# Altium schematic sheet 02 - PIO muxing.SchDoc
size B; CompanyName: Microchip Technology Inc.; Organization: Microchip Technology; Address1: 2355 West Chandler Blvd.; Address2: Chandler, AZ  85224; Address4: USA; DocumentNumber: 2; SheetNumber: 2; SheetTotal: 15; SheetTitle: PIO Muxing; Time: Time
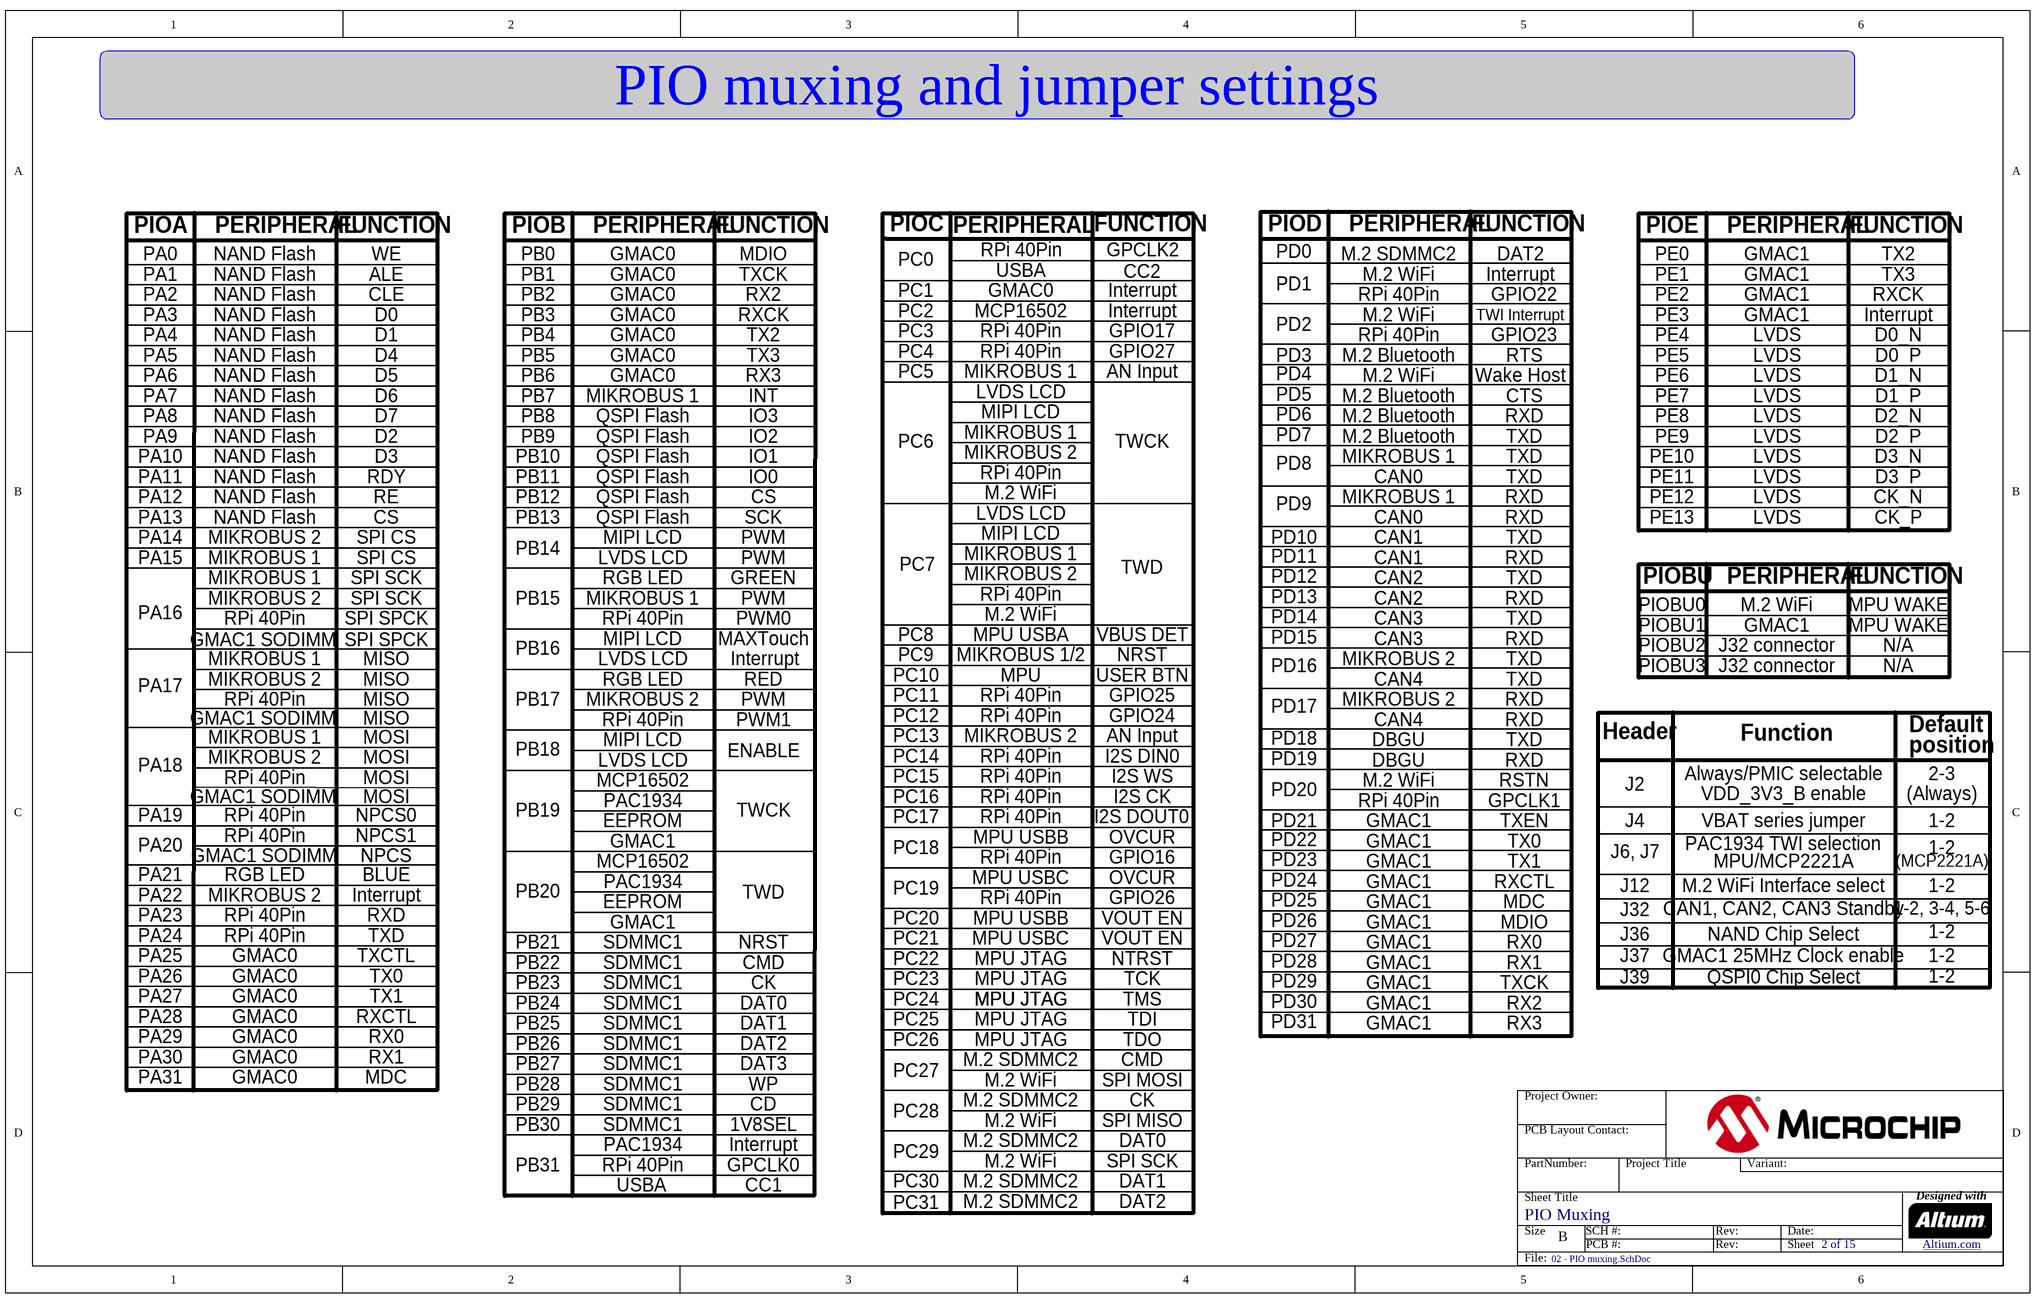
[diagram p0: 02 - PIO muxing.SchDoc]

## Notes on the sheet
- PIO muxing and jumper settings
- PIOA
- PERIPHERAL
- FUNCTION
- PIOB
- PIOC
- PIOD
- PIOE
- PA0
- PA1
- PA2
- NAND Flash
- WE
- ALE
- CLE
- PB0
- PB1
- PB2
- GMAC0
- MDIO
- TXCK
- RX2
- PC0
- PC1
- PC2
- MCP16502
- USBA
- RPi 40Pin
- Interrupt
- CC2
- GPCLK2
- PD0
- PD1
- M.2 SDMMC2
- M.2 WiFi
- DAT2
- GPIO22
- PE0
- PE1
- PE2
- GMAC1
- TX2
- TX3
- RXCK
- PA3
- PA4
- PA5
- PA6
- D0
- D1
- D4
- D5
- PB3
- PB4
- PB5
- PB6
- RX3
- PC3
- PC4
- PC5
- MIKROBUS 1
- GPIO17
- GPIO27
- AN Input
- PD2
- PD3
- PD4
- M.2 Bluetooth
- TWI Interrupt
- Wake Host
- GPIO23
- RTS
- PE3
- PE4
- PE5
- PE6
- LVDS
- D0_N
- D0_P
- D1_N
- PA7
- PA8
- PA9
- D2
- D6
- D7
- PB7
- PB8
- PB9
- QSPI Flash
- INT
- IO3
- IO2
- PC6
- LVDS LCD
- MIPI LCD
- TWCK
- PD5
- PD6
- PD7
- CTS
- RXD
- TXD
- PE7
- PE8
- PE9
- D2_P
- D1_P
- D2_N
- PA10
- PA11
- PA12
- PA13
- D3
- RDY
- RE
- CS
- PB10
- PB11
- PB12
- PB13
- IO1
- IO0
- SCK
- MIKROBUS 2
- PD8
- PD9
- CAN0
- PE10
- PE11
- PE12
- PE13
- D3_N
- D3_P
- CK_N
- CK_P
- PA14
- PA15
- SPI CS
- SPI SCK
- PB14
- RGB LED
- PWM
- GREEN
- PC7
- TWD
- PD10
- PD11
- PD12
- CAN1
- CAN2
- PA16
- GMAC1 SODIMM
- SPI SPCK
- PB15
- PB16
- PWM0
- MAXTouch
- PC8
- MPU USBA
- VBUS DET
- PD13
- PD14
- PD15
- CAN3
- PIOBU
- PIOBU0
- PIOBU1
- PIOBU2
- J32 connector
- MPU WAKE
- N/A
- PA17
- MISO
- PB17
- RED
- PC9
- PC10
- PC11
- PC12
- MIKROBUS 1/2
- MPU
- NRST
- USER BTN
- GPIO25
- GPIO24
- PD16
- PD17
- CAN4
- PIOBU3
- PA18
- MOSI
- PB18
- PWM1
- ENABLE
- PC13
- PC14
- PC15
- I2S DIN0
- I2S WS
- PD18
- PD19
- DBGU
- RSTN
- Header
- J2
- Always/PMIC selectable
- Function
- Default
- position
- 2-3
- PA19
- PA20
- NPCS0
- NPCS1
- PB19
- PAC1934
- EEPROM
- PC16
- PC17
- PC18
- MPU USBB
- I2S DOUT0
- I2S CK
- OVCUR
- PD20
- PD21
- PD22
- GPCLK1
- TXEN
- TX0
- J4
- J6, J7
- PAC1934 TWI selection
- VDD_3V3_B enable
- VBAT series jumper
- (Always)
- 1-2
- PA21
- PA22
- PA23
- BLUE
- NPCS
- PB20
- PC19
- PC20
- MPU USBC
- GPIO16
- GPIO26
- VOUT EN
- PD23
- PD24
- PD25
- PD26
- TX1
- RXCTL
- MDC
- J12
- J32
- MPU/MCP2221A
- M.2 WiFi Interface select
- CAN1, CAN2, CAN3 Standby
- (MCP2221A)
- 1-2, 3-4, 5-6
- PA24
- PA25
- PA26
- TXCTL
- PB21
- PB22
- PB23
- SDMMC1
- CMD
- CK
- PC21
- PC22
- PC23
- MPU JTAG
- NTRST
- TCK
- PD27
- PD28
- PD29
- RX0
- RX1
- J36
- J39
- J37
- NAND Chip Select
- QSPI0 Chip Select
- GMAC1 25MHz Clock enable
- PA27
- PA28
- PA29
- PA30
- PB24
- PB25
- PB26
- DAT0
- DAT1
- PC24
- PC25
- PC26
- TMS
- TDI
- TDO
- PD30
- PD31
- PA31
- PB27
- PB28
- PB29
- DAT3
- WP
- CD
- PC27
- PC28
- SPI MOSI
- SPI MISO
- PB30
- PB31
- 1V8SEL
- GPCLK0
- CC1
- PC29
- PC30
- PC31
- Project Owner:
- PCB Layout Contact:
- PartNumber:
- Project Title
- Variant:
- Sheet Title
- Size
- B
- SCH #:
- PCB #:
- Rev:
- Date:
- Sheet
- Designed with
- Altium.com <http://go.altium.com/MicrochipLandingPage_Evaluation.html>
- File: